# EAGLE design Sensor-TSL45315 (EAGLE 7.7.0)
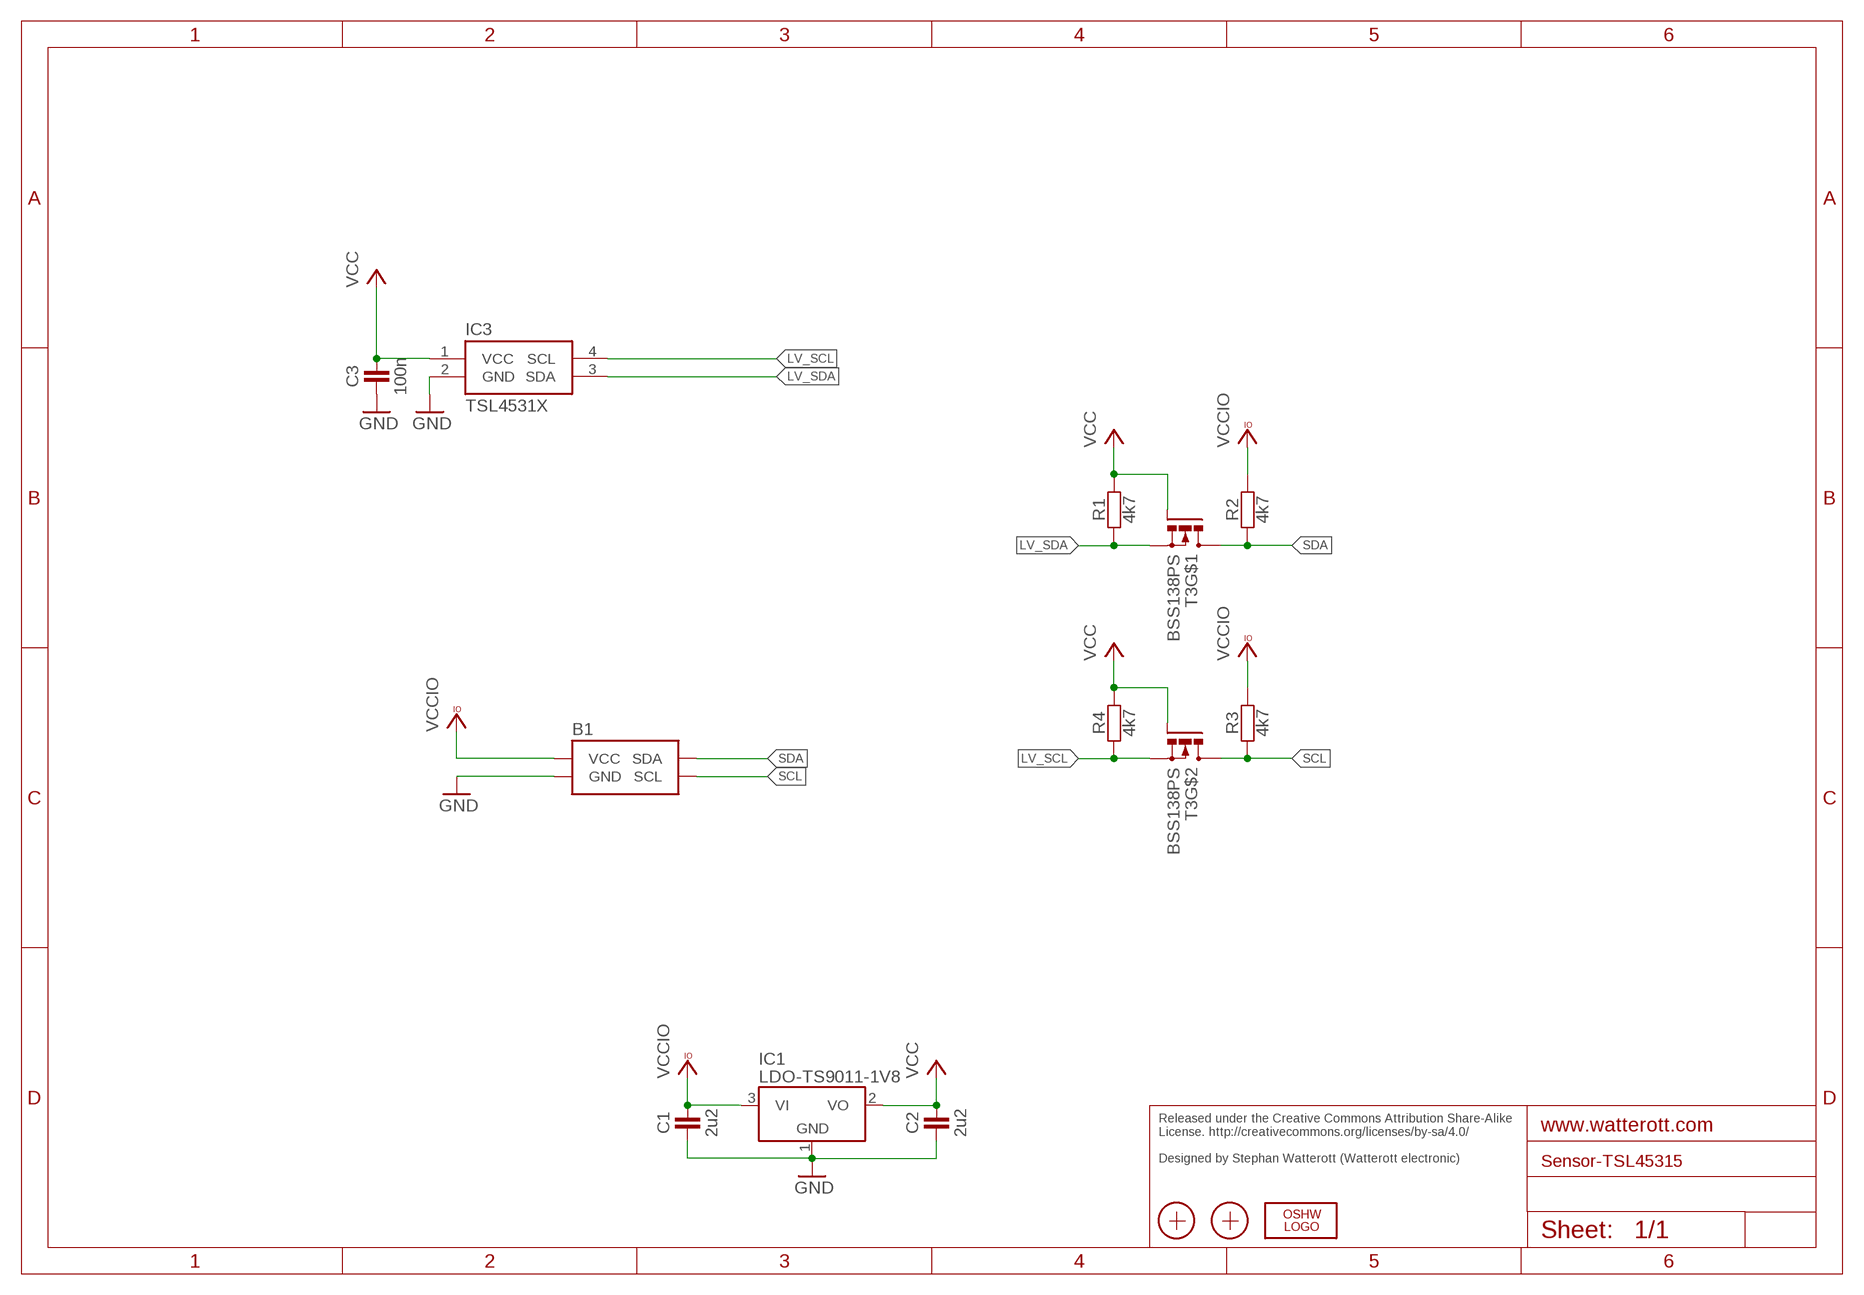
[diagram p0: schematic, sheet 1]

## Parts
B1  SENSEBOX_I2C  [SENSEBOX_I2C]
C1  2u2  CAPACITOR-C0402  [R0402]
C2  2u2  CAPACITOR-C0402  [R0402]
C3  100n  CAPACITOR-C0402  [R0402]
IC1  LDO-TS9011-1V8  LDO-TS9011-3V3  [SOT23]
IC3  TSL4531X  [AMS_CL]
LOGO2  OSHW_LOGOX0070  [OSHW_6X70]
R1  4k7  RESISTOR-R0402  [R0402]
R2  4k7  RESISTOR-R0402  [R0402]
R3  4k7  RESISTOR-R0402  [R0402]
R4  4k7  RESISTOR-R0402  [R0402]
T3  BSS138PS  [SOT363]
X1  PASSER-07  [PASSER_07MM]
X2  PASSER-07  [PASSER_07MM]

## Nets
GND: B1.GND C1.1 C2.1 C3.1 IC1.1(GND) IC3.2(GND)
LV_SCL: IC3.4(SCL) R4.1 T3.4(S)
LV_SDA: IC3.3(SDA) R1.1 T3.1(S)
SCL: B1.SCL R3.1 T3.3(D)
SDA: B1.SDA R2.1 T3.6(D)
VCC: C2.2 C3.2 IC1.2(VO) IC3.1(VCC) R1.2 R4.2 T3.2(G) T3.5(G)
VCCIO: B1.VCC C1.2 IC1.3(VI) R2.2 R3.2

## Notes on the sheet
- Released under the Creative Commons Attribution Share-Alike 
  License. http://creativecommons.org/licenses/by-sa/4.0/
  
  Designed by Stephan Watterott (Watterott electronic)

## Library data of the parts
B1 = we-board:SENSEBOX_I2C: SenseBox Sensors/Breakouts
C1-C3 = we-rcl:CAPACITOR: Capacitors ...4.7uF @ 6.3V -> 0402 ...10uF @ 16V -> 0603 ...22uF @ 25V -> 0805
IC1 = we-power:LDO: LDOs TS1117 800mA, Vin max 12V TS9011 250mA, Vin max 12V - compatible AP2210 300mA, Vin max 15V TS5204 150mA, Vin max 16V
IC3 = we-sensor:TSL4531X
LOGO2 = we-symbol:OSHW_LOGO
R1-R4 = we-rcl:RESISTOR: Resistors all kinds in 0603 and 0402
T3 = we-transistor:BSS138PS
X1 X2 = we-symbol:PASSER

## Board
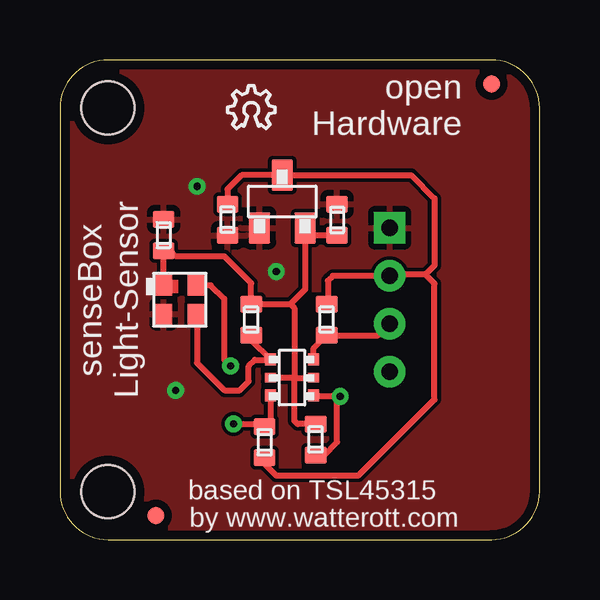
[diagram p1: board, top side]
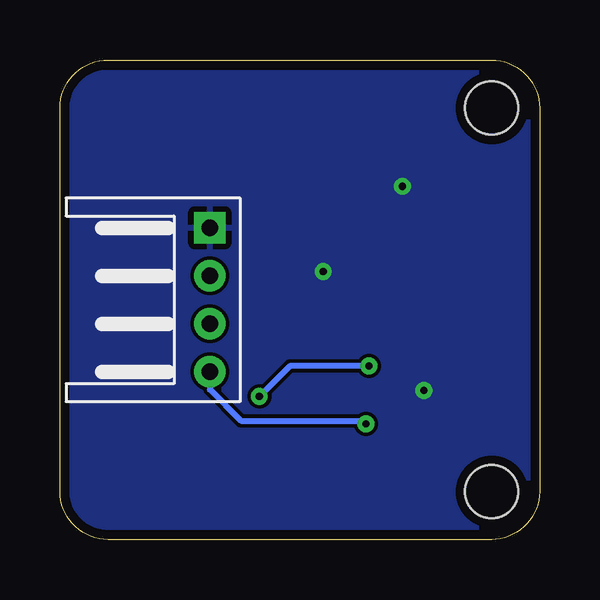
[diagram p2: board, bottom side, seen from below]

Size 20 x 20 mm. Coordinates in mm from the lower left corner, seen from the top.
Copper layers (1*16): Top 0.035mm / dielectric 1.5mm / Bottom 0.035mm
Design rules "we-dru-2-layer": minimum track width 0.15mm, minimum drill 0.3mm, track to track 0.15mm, track to pad 0.15mm, pad to pad 0.15mm, via to via 0.15mm, smd to smd 0.1mm, copper to edge 0.4mm, drill to drill 0.2mm, minimum pad ring 0.18mm, minimum via ring 0.2mm, stop-mask expansion 0.1mm, vias tented up to drill 0.5mm, thermal gap 0.25mm

### Footprints (pad centres in the part's own frame; a part is rotated, then mirrored left to right if it is on the bottom)
SENSEBOX_I2C = drill 0.7 pad 1.3 square: GND 13.75,13 | drill 0.7 pad 1.3: SCL 13.75,7; SDA 13.75,9; VCC 13.75,11 | hole 2.2: 2,18; 2,2
R0402 = smd 0.9 x 0.7: 1 0,0.65; 2 0,-0.65
SOT23 = smd 1.3 x 0.9: 1 -1.1,0.95; 2 -1.1,-0.95; 3 1.1,0
AMS_CL = smd 0.7 x 0.85: 1 -0.675,0.6; 2 -0.675,-0.6; 3 0.675,-0.6; 4 0.675,0.6
SOT363 = smd 0.5 x 0.5: 1 -0.9,0.75; 3 -0.9,-0.75; 4 0.9,-0.75; 6 0.9,0.75 | smd 0.5 x 0.4: 2 -0.9,0; 5 0.9,0
PASSER_07MM = smd 0.7 x 0.7: X 0,0

### Placement (x,y rotation side)
B1  0,0 0 top
C1  6.99,13.34 180 top
C2  11.56,13.34 0 top
C3  4.32,12.7 0 top
IC1  9.27,14.1 90 top
IC3  5,10 0 top
LOGO2  6.99,17.14 0 top
R1  7.98,9.17 180 top
R2  11.13,9.17 180 top
R3  8.53,4.06 0 top
R4  10.67,4.17 180 top
T3  9.68,6.76 0 top
X1  18,19 0 top
X2  4,1 0 top

### Tracks (layer width: path | path; a pad name or v marks a point on that pad's centre or on a via)
GND  (via drill 0.3)
  other vias: 4.83,6.22 9.02,11.18 5.71,14.73
  pour Top: 0,20 20,20 20,0 0,0
  pour Bottom: 0,20 20,20 20,0 0,0
LV_SCL  (via drill 0.3)
  Top 0.254: T3.4 10.62,5.97 v11.68,5.97 11.56,5.84 11.56,4.06 11.01,3.52 R4.1 | v7.11,7.24 6.86,7.49 6.86,10.03 6.29,10.6 IC3.4
  Bottom 0.254: v7.11,7.24 10.41,7.24 v11.68,5.97
LV_SDA
  Top 0.254: 7.96,8.51 R1.1 7.98,8.31 T3.1 8.76,7.49 8.13,7.49 7.87,7.24 7.87,6.6 7.49,6.22 6.86,6.22 5.71,7.37 5.71,9.36 IC3.3
SCL  (via drill 0.3)
  Top 0.254: T3.3 8.78,4.96 R3.1 8.42,4.83 v7.24,4.83
  Bottom 0.254: B1.SCL 13.75,6.26 12.45,4.95 7.37,4.95 v7.24,4.83
SDA
  Top 0.254: T3.6 10.58,7.97 R2.1 13.27,8.52 B1.SDA
VCC
  Top 0.254: R4.2 9.92,4.82 9.78,4.95 9.78,6.73 | 9.78,6.73 10.55,6.73 T3.5 | T3.2 9.75,6.76 | 9.75,6.76 9.78,6.73 | 9.61,9.82 R1.2 7.98,10.69 6.86,11.81 4.83,11.81 4.59,12.05 C3.2 4.32,10.6 IC3.1 | 9.61,9.82 9.78,9.65 9.78,6.78 9.75,6.76 | 9.61,9.82 10.22,10.43 IC1.2 10.53,12.69 C2.2
VCCIO
  Top 0.254: C1.2 6.99,14.61 7.58,15.2 IC1.3 14.65,15.2 15.62,14.22 15.62,11.43 15.24,11.05 | 15.24,11.05 13.8,11.05 B1.VCC 11.38,11 11.18,10.79 11.18,9.87 R2.2 | R3.2 8.53,3.15 9.02,2.67 12.45,2.67 15.62,5.84 15.62,10.67 15.24,11.05

### Text on the board
tPlace: open / Hardware | senseBox / Light-Sensor | based on TSL45315 | by www.watterott.com